# EAGLE schematic HeadphoneSlice (EAGLE 7.5.0)
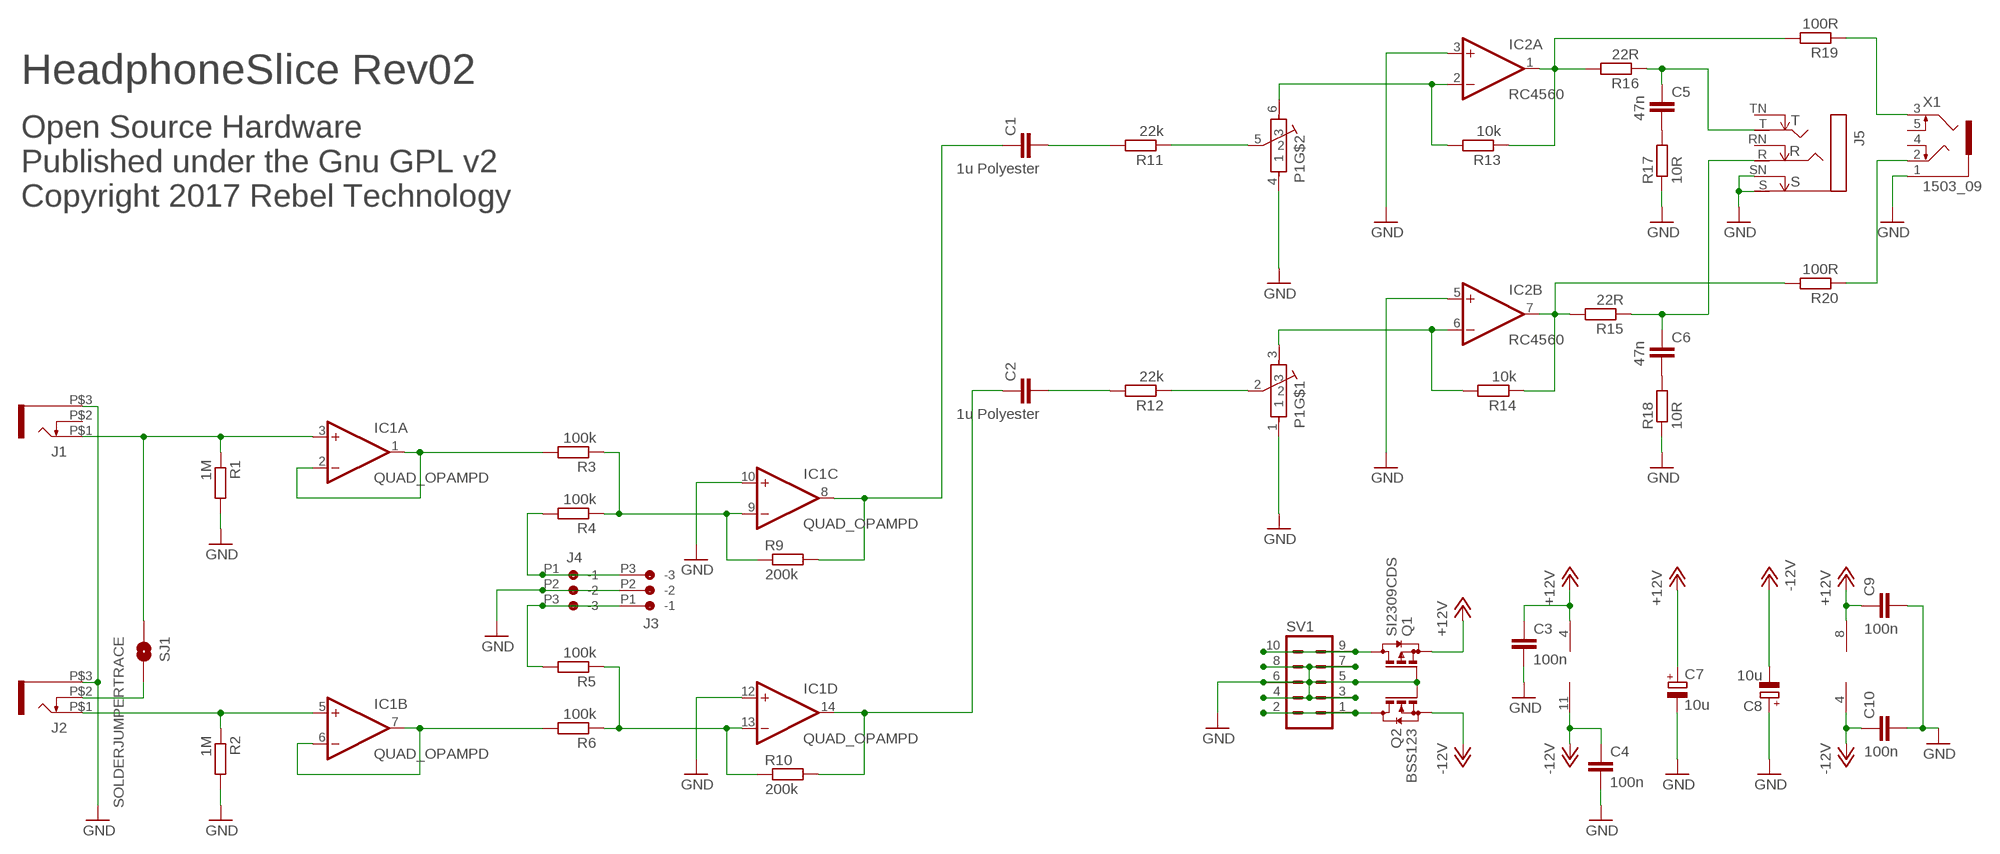
[diagram p0: schematic, sheet 1]

## Parts
C1  1u Polyester  C-EUC1210  [C1210]
C2  1u Polyester  C-EUC1210  [C1210]
C3  100n  C-EUC0603  [C0603]
C4  100n  C-EUC0603  [C0603]
C5  47n  C-EUC0603  [C0603]
C6  47n  C-EUC0603  [C0603]
C7  10u  CPOL-EU153CLV-0505  [153CLV-0505]
C8  10u  CPOL-EU153CLV-0505  [153CLV-0505]
C9  100n  C-EUC0603  [C0603]
C10  100n  C-EUC0603  [C0603]
IC1  QUAD_OPAMPD  [SO14]
IC2  RC4560  NE5532D  [SO08]
J1  JACK-UJ-3502-RSLOT  [UJ-3502-R-SLOT]
J2  JACK-UJ-3502-RSLOT  [UJ-3502-R-SLOT]
J3  CON-JST_PH_3W  [CON-JST_PH_3W]
J4  CON-JST_PH_3W  [CON-JST_PH_3W]
J5  NEUTRIK_NRJ6HFSTD  [NRJ6HF]
P1  POT-BOURNS-PTD902  [POT-BOURNS-PTD902]
Q1  SI2309CDS  BSS84  [SOT23]
Q2  BSS123  [SOT23]
R1  1M  R-EU_0603  [0603]
R2  1M  R-EU_0603  [0603]
R3  100k  R-EU_0603  [0603]
R4  100k  R-EU_0603  [0603]
R5  100k  R-EU_0603  [0603]
R6  100k  R-EU_0603  [0603]
R9  200k  R-EU_0603  [0603]
R10  200k  R-EU_0603  [0603]
R11  22k  R-EU_0603  [0603]
R12  22k  R-EU_0603  [0603]
R13  10k  R-EU_0603  [0603]
R14  10k  R-EU_0603  [0603]
R15  22R  R-EU_0603  [0603]
R16  22R  R-EU_0603  [0603]
R17  10R  R-EU_0603  [0603]
R18  10R  R-EU_0603  [0603]
R19  100R  R-EU_0603  [0603]
R20  100R  R-EU_0603  [0603]
SJ1  SOLDERJUMPERTRACE  [SJ_2S-TRACE]
SV1  MA05-2  [MA05-2]
X1  1503_09  [1503_09]

## Nets
+12V: C3.1 C7.+ C9.1 IC1.4(P:V+) IC2.8(P:V+) Q1.2(S)
-12V: C4.1 C8.- C10.1 IC1.11(P:V-) IC2.4(P:V-) Q2.2(S)
BUS_IN_L: J3.P3(-3) J4.P1(-1) R4.2
BUS_IN_R: J3.P1(-1) J4.P3(-3) R5.2
GND: C3.2 C4.2 C7.- C8.+ C9.2 C10.2 IC1.10(C:+IN) IC1.12(D:+IN) IC2.3(A:+IN) IC2.5(B:+IN) J1.P$3(SLEEVE) J2.P$3(SLEEVE) J3.P2(-2) J4.P2(-2) J5.S J5.SN P1.1 P1.4 Q1.1(G) Q2.1(G) R1.2 R2.2 R17.1 R18.1 SV1.3 SV1.4 SV1.5 SV1.6 SV1.7 SV1.8 X1.1
HP_L: C5.1 J5.T R16.1
HP_R: C6.1 J5.R R15.1
IN_B1: J2.P$2(SW) SJ1.2
IN_L: IC1.3(A:+IN) J1.P$1(TIP) R1.1 SJ1.1
IN_R: IC1.5(B:+IN) J2.P$1(TIP) R2.1
LINE_L: R19.1 X1.3
LINE_R: R20.1 X1.2
N$1: Q2.3(D) SV1.1 SV1.2
N$2: IC2.7(B:OUT) R14.1 R15.2 R20.2
N$3: IC2.2(A:-IN) P1.6 R13.2
N$4: C2.2 R12.2
N$5: P1.5 R11.1
N$6: P1.2 R12.1
N$7: C2.1 IC1.14(D:OUT) R10.2
N$8: C1.2 R11.2
N$10: C1.1 IC1.8(C:OUT) R9.2
N$11: IC1.6(B:-IN) IC1.7(B:OUT) R6.2
N$12: C6.2 R18.2
N$13: IC1.1(A:OUT) IC1.2(A:-IN) R3.2
N$14: Q1.3(D) SV1.9 SV1.10
N$16: IC2.6(B:-IN) P1.3 R14.2
N$19: IC2.1(A:OUT) R13.1 R16.2 R19.2
N$21: C5.2 R17.2
N$45: IC1.13(D:-IN) R5.1 R6.1 R10.1
N$50: IC1.9(C:-IN) R3.1 R4.1 R9.1
Unconnected: J1.P$2(SW) J5.RN J5.TN X1.4 X1.5

## Notes on the sheet
- HeadphoneSlice Rev02
- Open Source Hardware
  Published under the Gnu GPL v2
  Copyright 2017 Rebel Technology

## Library data of the parts
C1-C6 C9 C10 = Rebel:C-EU: CAPACITOR, European symbol
C7 C8 = rcl:CPOL-EU: POLARIZED CAPACITOR, European symbol
IC1 = adafruit:QUAD_OPAMP: OP AMP Standard quad package
IC2 = linear:NE5532: AUDIO AMPLIFIER
J1 J2 = Rebel:JACK-UJ-3502-R
J3 J4 = Rebel:CON-JST_PH_3W
J5 = neutrik_jacks:NEUTRIK_NRJ6HF
P1 = Rebel:POT-BOURNS-PTD902
Q1 = transistor-small-signal:BSS84: P-CHANNEL MOS FET
Q2 = transistor-small-signal:BSS123: N-CHANNEL MOS FET
R1-R6 R9-R20 = Rebel:R-EU_: RESISTOR, European symbol
SJ1 = SparkFun:SOLDERJUMPER: Solder Jumper Standard SMD solder jumper. Used to automate production. Two varients : Normally Open and Normally Closed are the same, but have different paste layers. NC will have a large amount of paste and should jumper during reflow.
SV1 = con-lstb:MA05-2: PIN HEADER; OC_FARNELL: unknown; OC_NEWARK: unknown
X1 = con-lumberg:1503_09: Jack connectors according to JISC 6560, 3.5 mm Klinkeneinbaukupplung nach JISC 6560, 3,5 mm, 3-polig/ stereo, abgewinkelte Ausführung, mit 2 Öffnern und Lötaugen, für Leiterplatten Rückseitenmontage Source: http://www.lumberg.com/Produkte/PDFs/1503_09.pdf; OC_FARNELL: 1243244; OC_NEWARK: unknown